# EAGLE design blinky_schematic (EAGLE 7.5.0)
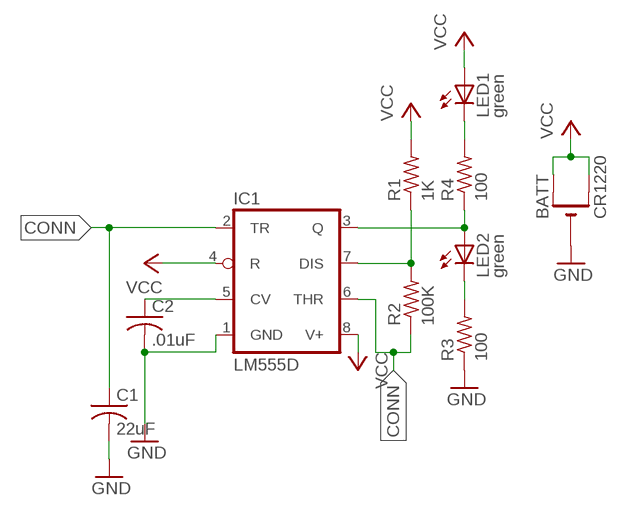
[diagram p0: schematic, sheet 1]

## Parts
BATT  CR1220  CR1220SMT  [CR1220-SMD]
C1  22uF  C-USC0805  [C0805]
C2  .01uF  C-USC0805  [C0805]
IC1  LM555D  [SO08]
LED1  green  LEDCHIPLED_0805  [CHIPLED_0805]
LED2  green  LEDCHIPLED_0805  [CHIPLED_0805]
R1  1K  R-US_R0805  [R0805]
R2  100K  R-US_R0805  [R0805]
R3  100  R-US_R0805  [R0805]
R4  100  R-US_R0805  [R0805]

## Nets
CONN: C1.1 IC1.2(TR) IC1.6(THR) R2.1
GND: BATT.- C1.2 C2.2 IC1.1(GND) R3.1
N$1: LED1.C R4.2
N$2: IC1.3(Q) LED2.A R4.1
N$3: LED2.C R3.2
N$4: IC1.7(DIS) R1.1 R2.2
N$10: C2.1 IC1.5(CV)
VCC: BATT.+$1(+) BATT.+$2(+1) IC1.4(R) IC1.8(V+) LED1.A R1.2

## Library data of the parts
BATT = adafruit:CR1220: CR1216/CR1220/CR1225 12mm 3V lithium coin cell Great for battery packup. Both SMT and THM holders. Note the THM package has the ground pads on both sides of the PCB so that the masks are the same - this reduces the cost; MPN: 3080; OC_NEWARK: 25T0433
C1 = adafruit:C-US: CAPACITOR, American symbol; MPN: F981A226MSAAS1; OC_NEWARK: 42Y0339
C2 = adafruit:C-US: CAPACITOR, American symbol; MPN: 0805PC103KAZ1A; OC_NEWARK: 10R5948
IC1 = adafruit:*555: TIMER Changed DIP package to have round (not oval) pin pads http://www.ladyada.net/library/pcb/eaglelibrary.html; MPN: 1526; OC_NEWARK: 28Y4804
LED1 LED2 = adafruit:LED: LED OSRAM: - CHIPLED LG R971, LG N971, LY N971, LG Q971, LY Q971, LO R971, LY R971 LH N974, LH R974 LS Q976, LO Q976, LY Q976 LO Q996 - Hyper CHIPLED LW Q18S LB Q993, LB Q99A, LB R99A - SideLED LS A670, LO A670, LY A670, LG A670, LP A670 LB A673, LV A673, LT A673, LW A673 LH A674 LY A675 LS A676, LA A676, LO A676, LY A676, LW A676 LS A679, LY A679, LG A679 - Hyper Micro SIDELED® LS Y876, LA Y876, LO Y876, LY Y876 LT Y87S - SmartLED LW L88C, LW L88S LB L89C, LB L89S, LG L890 LS L89K, LO L89K, LY L89K LS L896, LA L896, LO L896, LY L896 - TOPLED LS T670, LO T670, LY T670, LG T670, LP T670 LSG T670, LSP T670, LSY T670, LOP T670, LYG T670 LG T671, LOG T671, LSG T671 LB T673, LV T673, LT T673, LW T673 LH T674 LS T676, LA T676, LO T676, LY T676, LB T676, LH T676, LSB T676, LW T676 LB T67C, LV T67C, LT T67C, LS T67K, LO T67K, LY T67K, LW E67C LS E67B, LA E67B, LO E67B, LY E67B, LB E67C, LV E67C, LT E67C LW T67C LS T679, LY T679, LG T679 LS T770, LO T770, LY T770, LG T770, LP T770 LB T773, LV T773, LT T773, LW T773 LH T774 LS E675, LA E675, LY E675, LS T675 LS T776, LA T776, LO T776, LY T776, LB T776 LHGB T686 LT T68C, LB T68C - Hyper Mini TOPLED® LB M676 - Mini TOPLED Santana® LG M470 LS M47K, LO M47K, LY M47K Source: http://www.osram.convergy.de/; MPN: 5988170107F; OC_NEWARK: 75R0587
R1 = adafruit:R-US_: RESISTOR, American symbol; MPN: ERJ-6ENF1601V; OC_NEWARK: 53W4749
R2 = adafruit:R-US_: RESISTOR, American symbol; MF: VISHAY/DALE; MPN: CRCW0805100KFKTA; OC_NEWARK: 05F1513
R3 R4 = adafruit:R-US_: RESISTOR, American symbol; MPN: MCHP05W4F1000T5E; OC_NEWARK: 01N6987

## Net classes
0 default: width 0.305 mm, drill 0.508 mm, clearance 0.254 mm

## Board
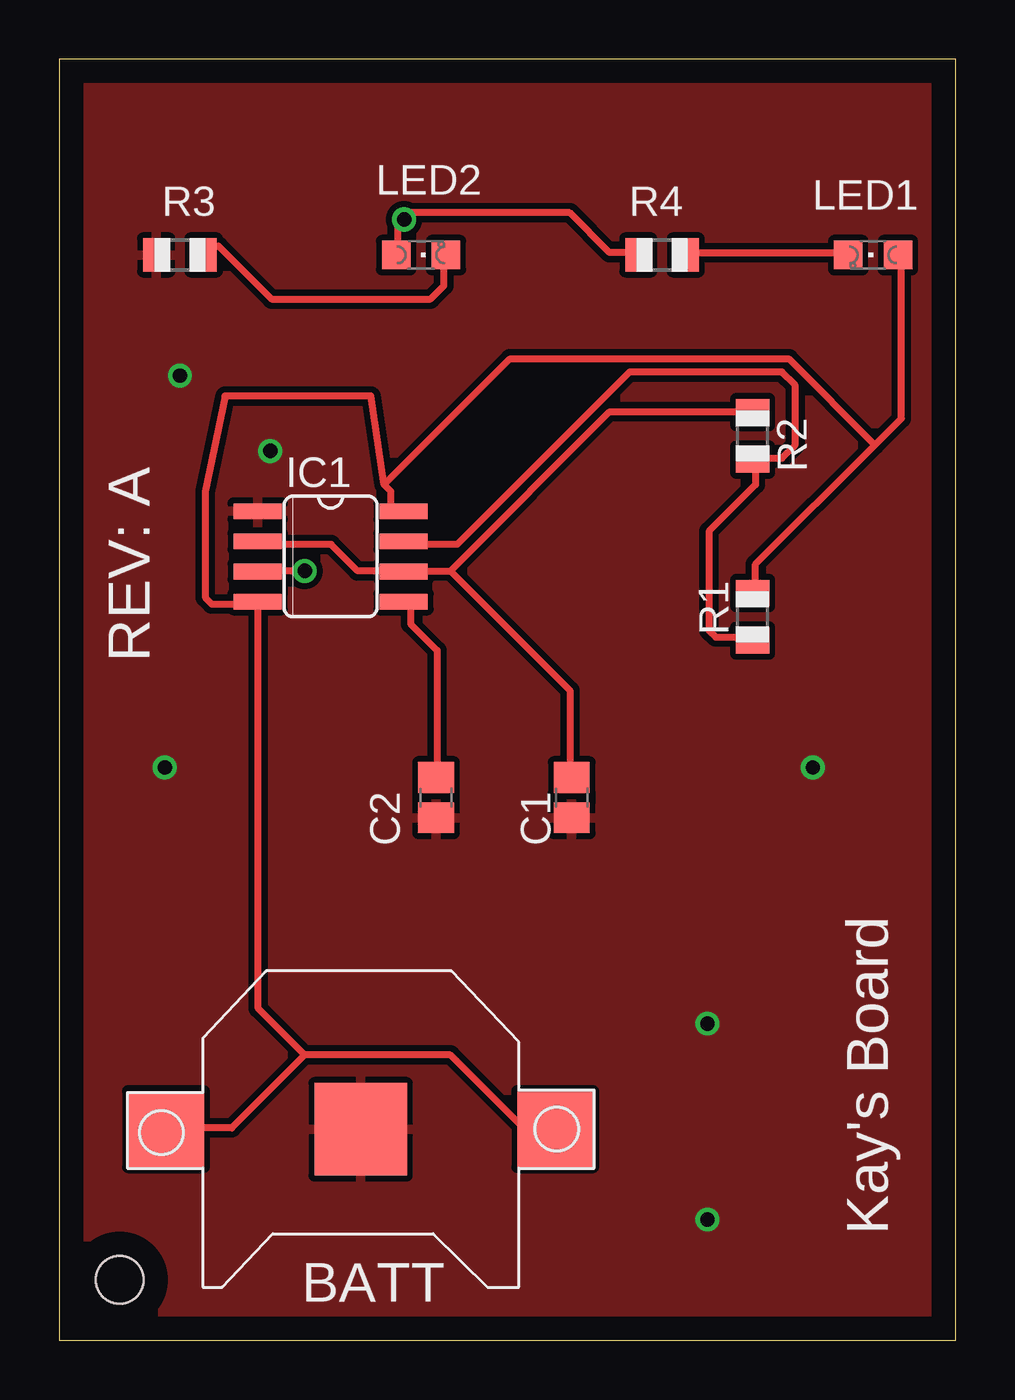
[diagram p1: board, top side]
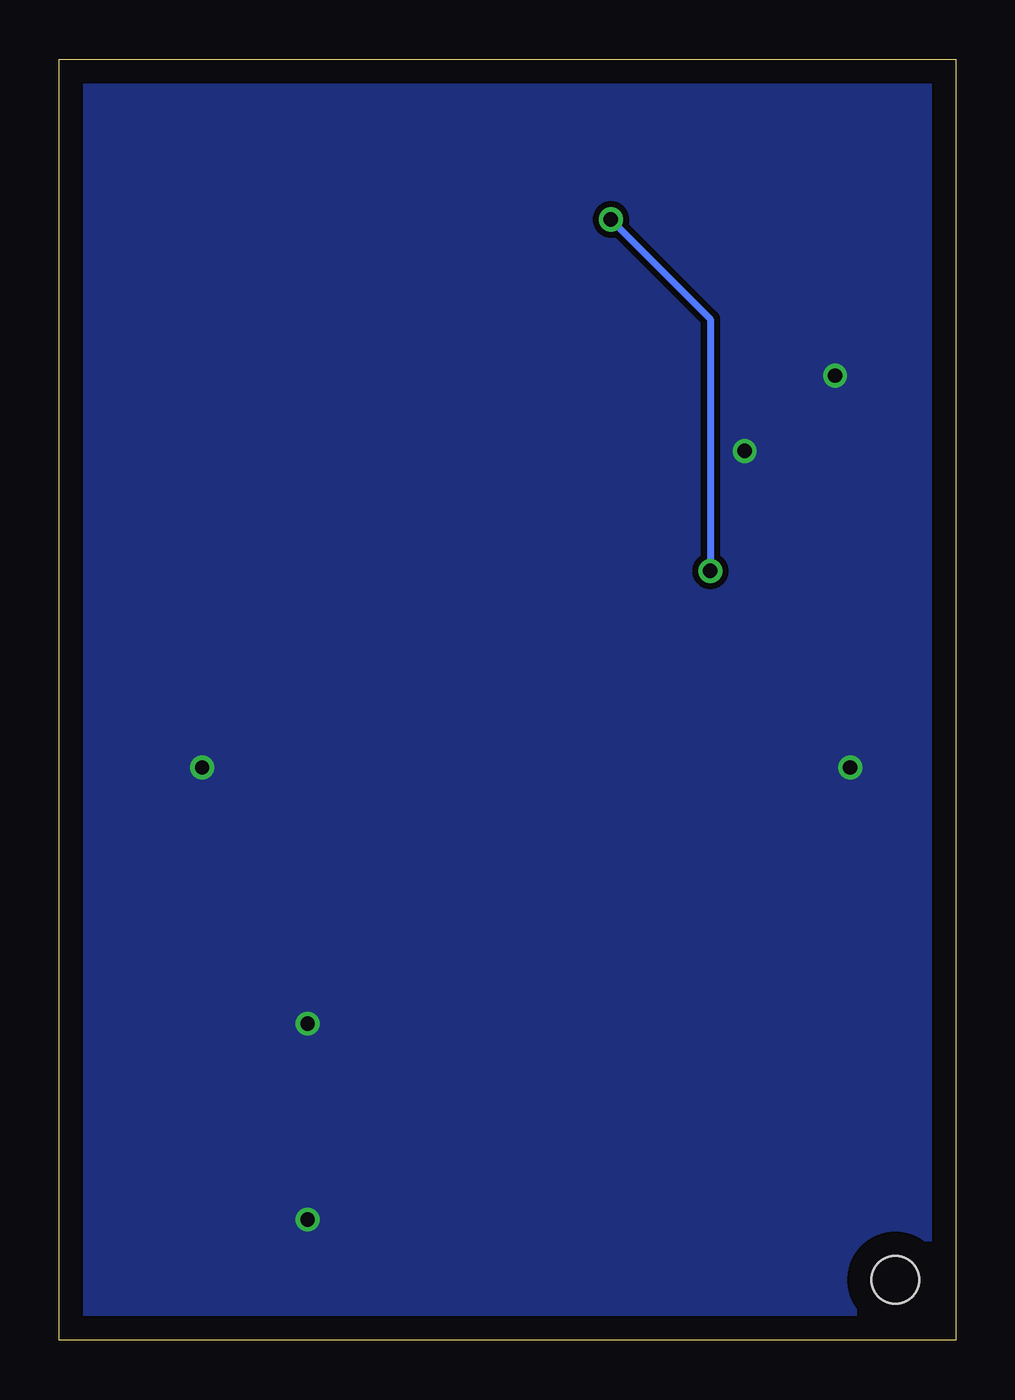
[diagram p2: board, bottom side, seen from below]

Size 37.77 x 53.97 mm. Coordinates in mm from the lower left corner, seen from the top.
Outline: 0,0 37.77,0 37.77,53.97 0,53.97 0,0
Copper layers (1*16): Top 0.035mm / dielectric 1.5mm / Bottom 0.035mm
Design rules "default *": minimum track width 10mil, minimum drill 20mil, track to track 8mil, track to pad 8mil, pad to pad 8mil, via to via 8mil, smd to smd 8mil, copper to edge 40mil, drill to drill 8mil, minimum pad ring 10mil, minimum via ring 8mil, stop-mask expansion 4mil, vias tented up to drill 0mil, thermal gap 10mil
Holes 2 mm at 2.54,2.54

### Footprints (pad centres in the part's own frame; a part is rotated, then mirrored left to right if it is on the bottom)
CR1220-SMD = smd 3.2 x 3.2: +$1 -8.2,0; +$2 8.2,0 | smd 3.9 x 3.9: - 0,0
C0805 = smd 1.3 x 1.5: 1 -0.85,0; 2 0.85,0
SO08 = smd 0.66 x 2.032: 1 -1.905,-3.073; 2 -0.635,-3.073; 3 0.635,-3.073; 4 1.905,-3.073; 5 1.905,3.073; 6 0.635,3.073; 7 -0.635,3.073; 8 -1.905,3.073
CHIPLED_0805 = smd 1.2 x 1.2: A 0,-1.05; C 0,1.05
R0805 = smd 1.1 x 1.4: 1 -1,0; 2 1,0

### Placement (x,y rotation side)
BATT  12.7,8.89 180 top
C1  21.59,22.86 270 top
C2  15.88,22.86 270 top
IC1  11.43,33.02 270 top
LED1  34.29,45.72 90 top
LED2  15.24,45.72 270 top
R1  29.21,30.48 90 top
R2  29.21,38.1 270 top
R3  5.08,45.72 0 top
R4  25.4,45.72 0 top

### Tracks (layer width: path | path; a pad name or v marks a point on that pad's centre or on a via)
CONN
  Top 0.305: 16.48,32.41 23.19,39.12 29.06,39.12 R2.1 | 16.48,32.41 14.53,32.41 IC1.6 14.25,32.41 12.57,32.41 11.46,33.53 8.38,33.53 IC1.2 | 16.48,32.41 21.51,27.38 21.51,23.75 C1.1
GND  (via drill 0.6)
  other vias: 5.08,40.64 8.89,37.47 4.45,24.13 31.75,24.13 27.3,13.34 27.3,5.08
  pour Top: -1.27,58.42 39.37,58.42 39.37,-1.27 -1.27,-1.27
  pour Bottom: -0.64,-0.64 38.1,-0.64 38.1,0.64 38.1,57.78 -0.64,57.78
N$1
  Top 0.305: LED1.C 32.97,45.82 26.54,45.82 R4.2
N$2  (via drill 0.61)
  Top 0.305: LED2.A 14.25,45.82 14.25,46.94 v14.53,47.22 14.81,47.5 21.51,47.5 23.19,45.82 24.31,45.82 R4.1 | v10.34,32.41 8.38,32.41 IC1.3
  Bottom 0.305: v10.34,32.41 10.34,43.03 v14.53,47.22
N$3
  Top 0.305: LED2.C 16.2,45.54 16.2,44.42 15.65,43.87 8.94,43.87 6.71,46.1 6.43,46.1 6.15,45.82 R3.2
N$4
  Top 0.305: R1.1 29.06,29.62 27.66,29.62 27.38,29.9 27.38,34.09 29.34,36.04 29.34,36.88 R2.2 29.34,37.16 30.45,37.16 31.01,37.72 31.01,40.23 30.45,40.79 24.03,40.79 16.76,33.53 14.53,33.53 IC1.7
N$10
  Top 0.305: C2.1 15.93,23.75 15.93,29.06 14.81,30.18 14.81,31.01 14.53,31.29 IC1.5
VCC
  Top 0.305: 34.37,37.72 29.34,32.69 29.34,31.57 R1.2 | 34.37,37.72 35.48,38.84 35.48,45.54 LED1.A | 13.69,36.04 13.97,35.76 13.97,34.92 IC1.8 | 13.69,36.04 13.13,39.78 6.99,39.78 6.15,35.76 6.15,31.29 6.43,31.01 8.1,31.01 IC1.4 8.38,31.01 8.38,13.97 10.34,12.01 | 10.34,12.01 7.26,8.94 4.75,8.94 BATT.+$2 | 10.34,12.01 16.48,12.01 19.56,8.94 20.68,8.94 BATT.+$1 | 34.37,37.72 30.73,41.35 19,41.35 13.69,36.04

### Text on the board
tPlace: REV: A | Kay's Board